# EAGLE design bbc_micro (EAGLE 9.6.1)
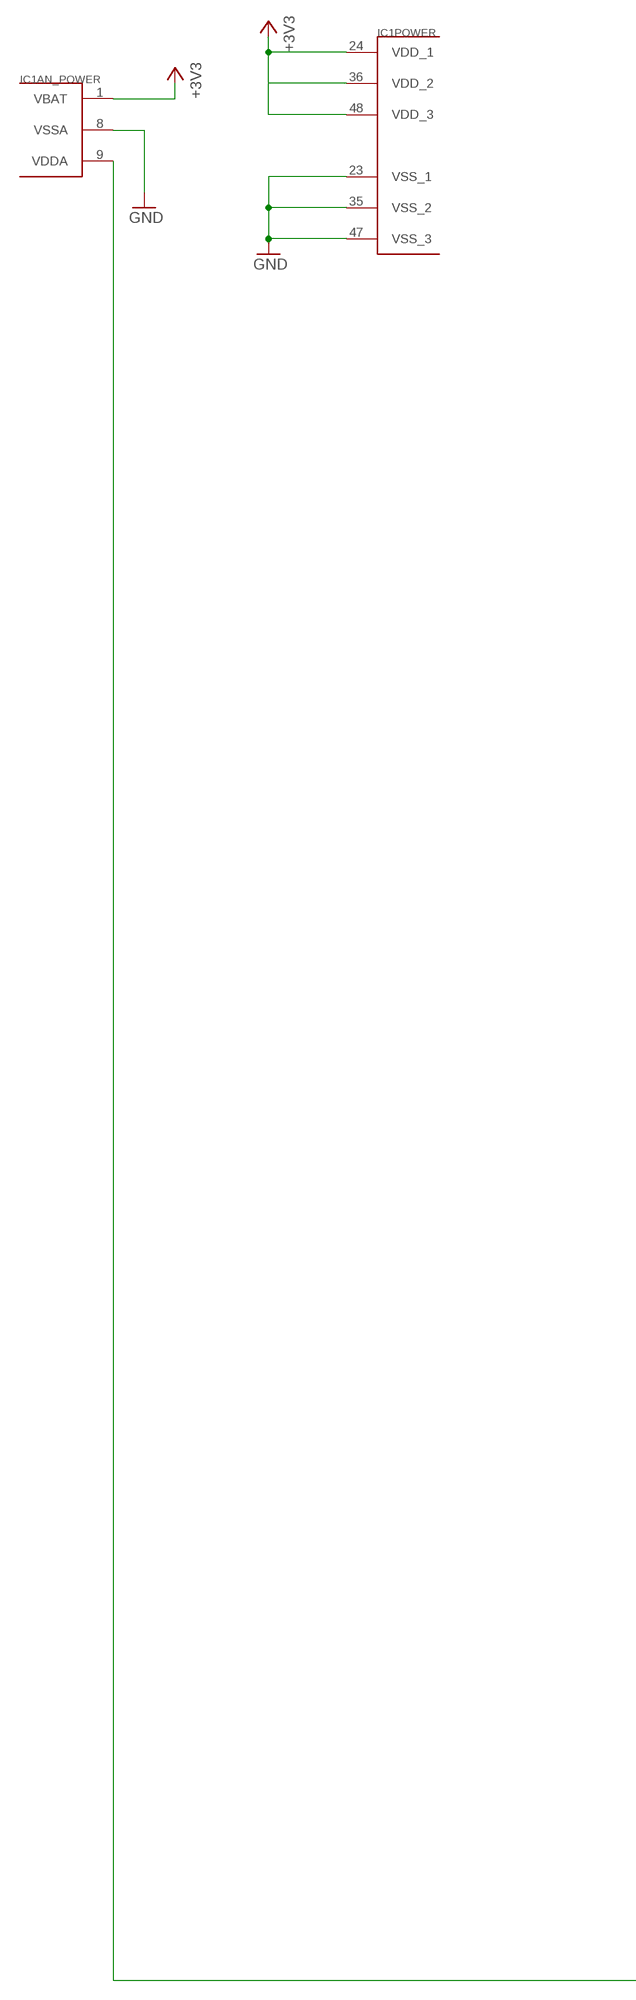
[diagram p0: schematic, sheet 1, part 1 of 2]
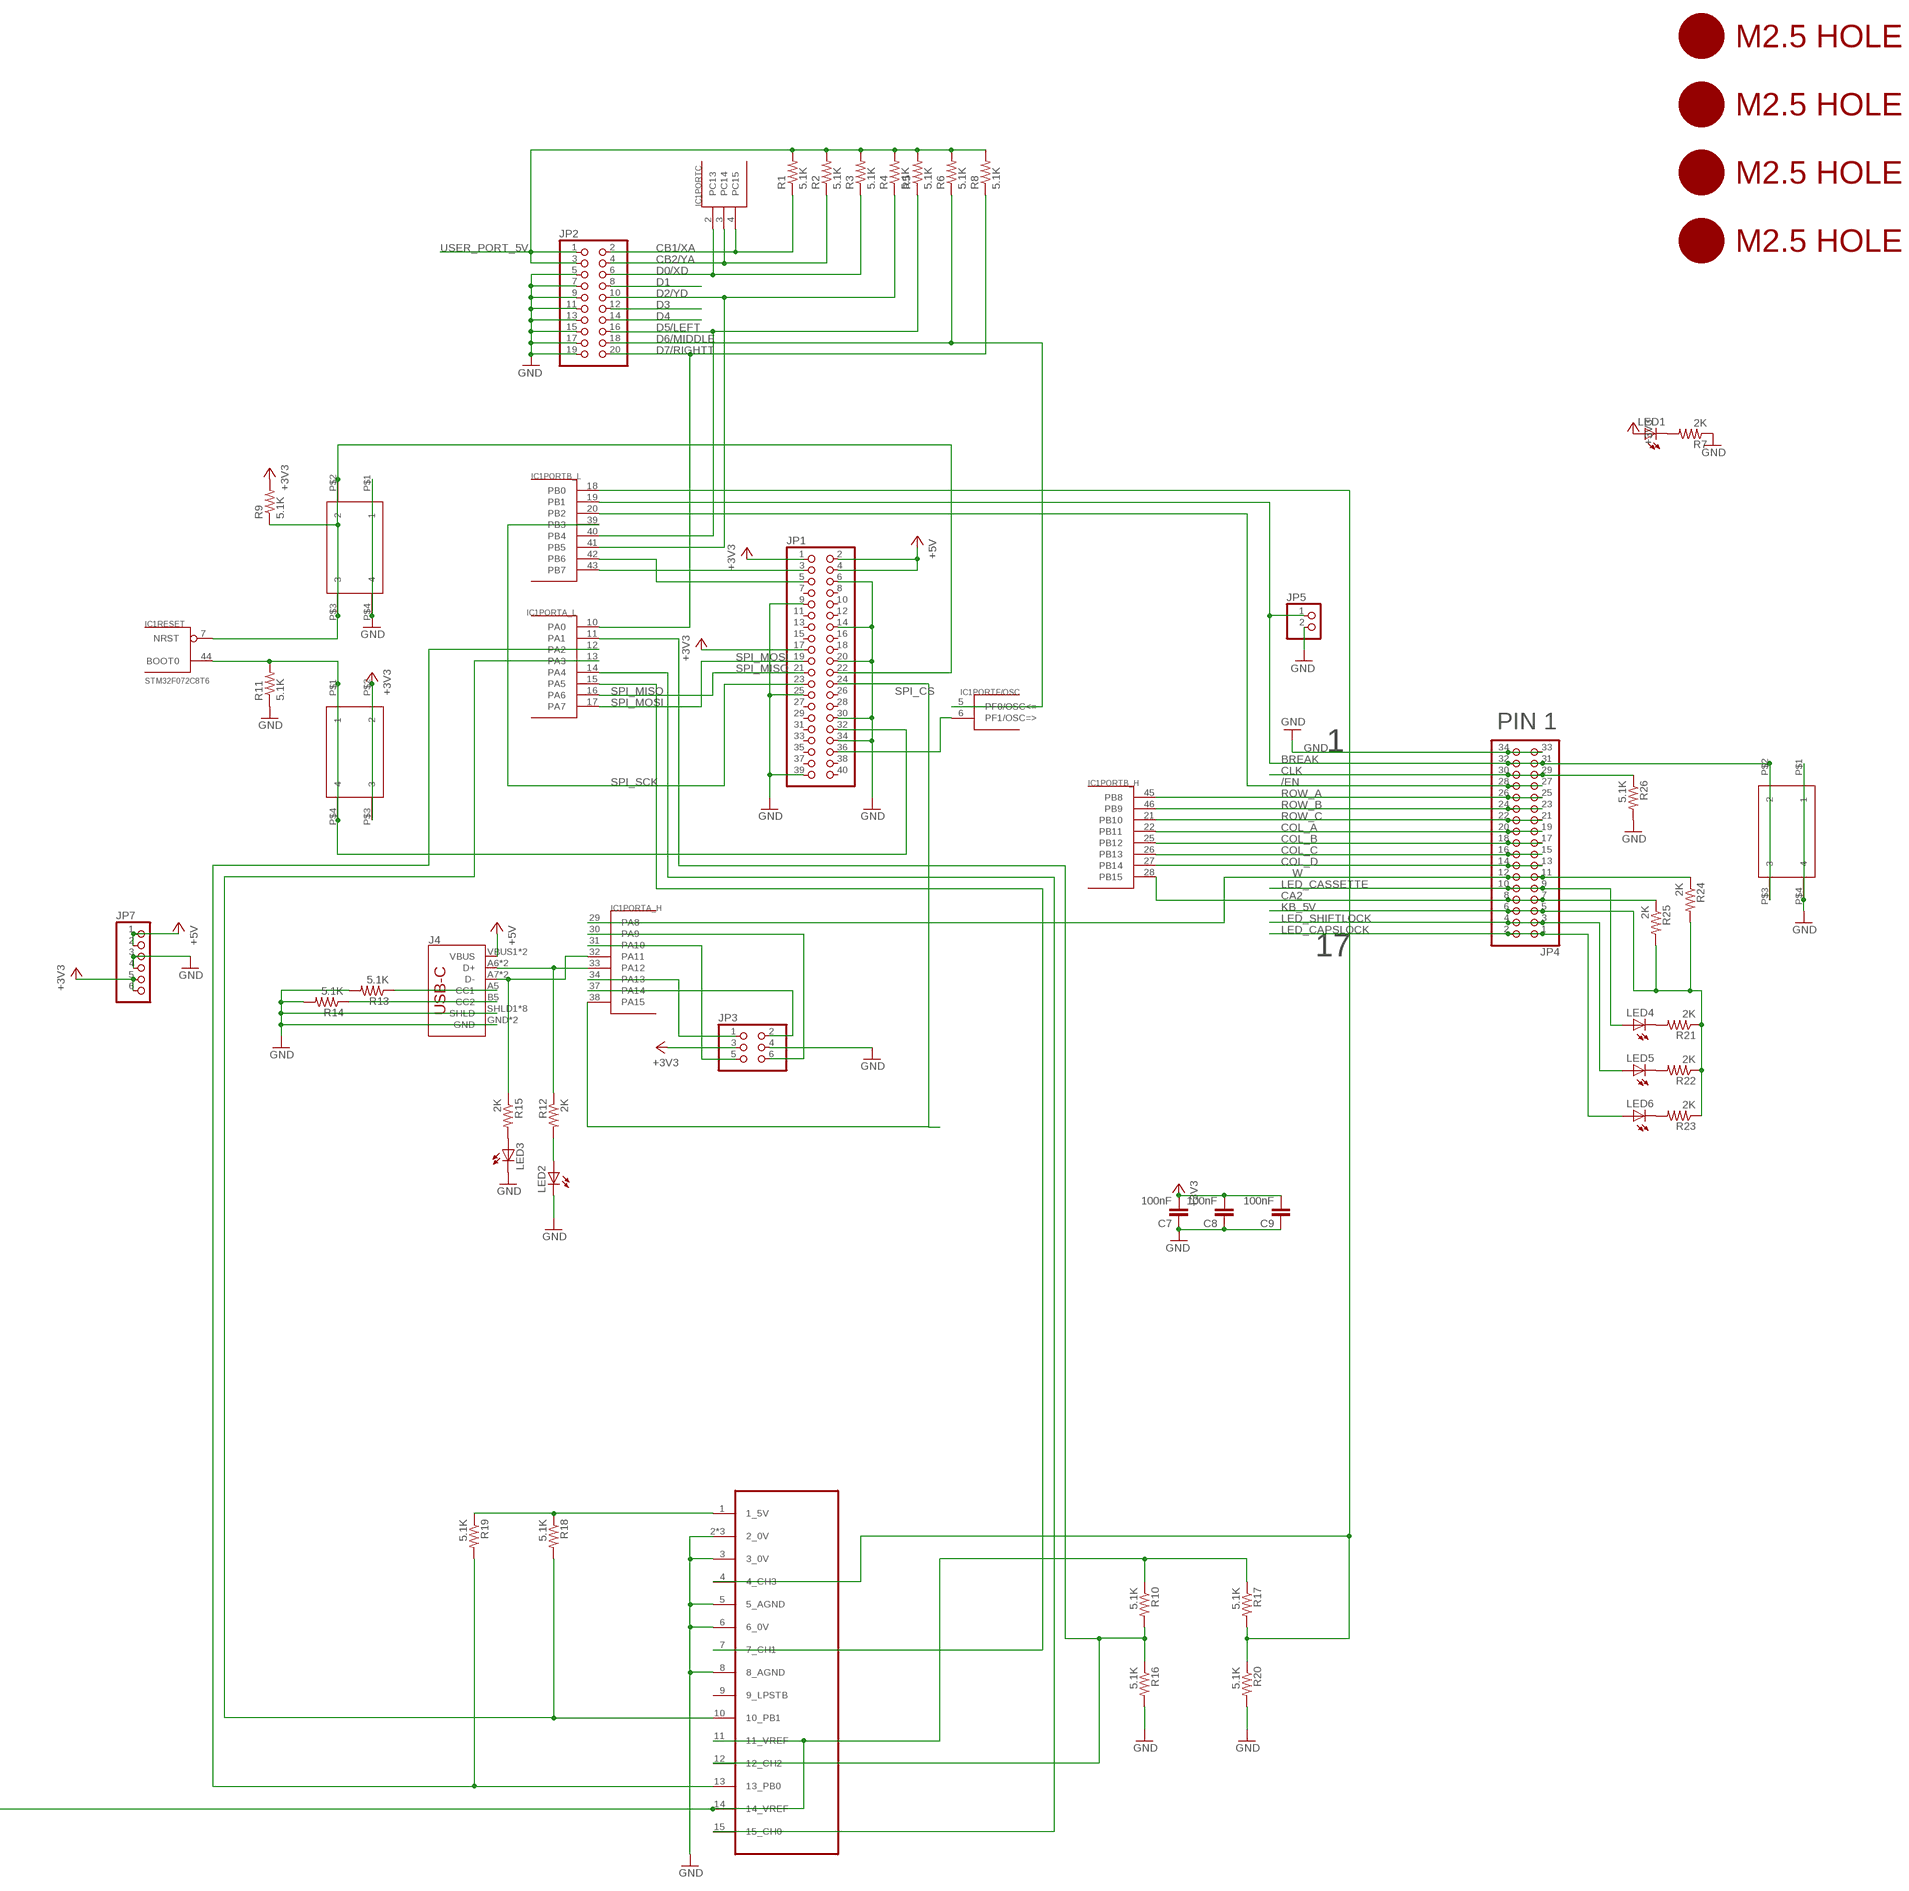
[diagram p1: schematic, sheet 1, part 2 of 2]

## Parts
C7  100nF  CAP0805  [0805@1]
C8  100nF  CAP0805  [0805@1]
C9  100nF  CAP0805  [0805@1]
IC1  STM32F072C8T6  [TQFP48]
J4  USB_C16PIN  [USB-C-16P]
JP1  PINHD-2X20-BIG  [2X20-BIG]
JP2  PINHD-2X10/90  [2X10/90]
JP3  PINHD-2X3  [2X03]
JP4  PINHD-2X17/90  [2X17/90]
JP5  PINHD-1X2  [1X02]
JP7  PINHD-1X6CB  [1X06-CLEANBIG]
LED1  LEDCHIP-LED0805  [CHIP-LED0805]
LED2  LEDCHIP-LED0805  [CHIP-LED0805]
LED3  LEDCHIP-LED0805  [CHIP-LED0805]
LED4  LEDCHIP-LED0805  [CHIP-LED0805]
LED5  LEDCHIP-LED0805  [CHIP-LED0805]
LED6  LEDCHIP-LED0805  [CHIP-LED0805]
R1  5.1K  RESISTOR0805-RES  [0805]
R2  5.1K  RESISTOR0805-RES  [0805]
R3  5.1K  RESISTOR0805-RES  [0805]
R4  5.1K  RESISTOR0805-RES  [0805]
R5  5.1K  RESISTOR0805-RES  [0805]
R6  5.1K  RESISTOR0805-RES  [0805]
R7  2K  RESISTOR0805-RES  [0805]
R8  5.1K  RESISTOR0805-RES  [0805]
R9  5.1K  RESISTOR0805-RES  [0805]
R10  5.1K  RESISTOR0805-RES  [0805]
R11  5.1K  RESISTOR0805-RES  [0805]
R12  2K  RESISTOR0805-RES  [0805]
R13  5.1K  RESISTOR0805-RES  [0805]
R14  5.1K  RESISTOR0805-RES  [0805]
R15  2K  RESISTOR0805-RES  [0805]
R16  5.1K  RESISTOR0805-RES  [0805]
R17  5.1K  RESISTOR0805-RES  [0805]
R18  5.1K  RESISTOR0805-RES  [0805]
R19  5.1K  RESISTOR0805-RES  [0805]
R20  5.1K  RESISTOR0805-RES  [0805]
R21  2K  RESISTOR0805-RES  [0805]
R22  2K  RESISTOR0805-RES  [0805]
R23  2K  RESISTOR0805-RES  [0805]
R24  2K  RESISTOR0805-RES  [0805]
R25  2K  RESISTOR0805-RES  [0805]
R26  5.1K  RESISTOR0805-RES  [0805]
SW1  324_SW  [342_SWICH_FOOT]
SW2  324_SW  [342_SWICH_FOOT]
SW3  324_SW  [342_SWICH_FOOT]
U$2  M2.5HOLE  [M2.5HOLE]
U$3  M2.5HOLE  [M2.5HOLE]
U$6  M2.5HOLE  [M2.5HOLE]
U$7  M2.5HOLE  [M2.5HOLE]
U$9  BBC_15P  [DA15]

## Nets
+3V3: C7.2 C8.2 C9.2 IC1.1(AN_POWER:VBAT) IC1.24(POWER:VDD_1) IC1.36(POWER:VDD_2) IC1.48(POWER:VDD_3) JP1.1 JP1.17 JP3.3 JP7.5 JP7.6 LED1.A R9.2 SW2.P$2 SW2.P$3
+5V: J4.VBUS1(VBUS) J4.VBUS2(VBUS) JP1.2 JP1.4 JP7.1 JP7.2
/EN: IC1.20(PORTB_L:PB2) JP4.27 JP4.28
BREAK: IC1.19(PORTB_L:PB1) JP4.31 JP4.32 JP5.1 SW3.P$2 SW3.P$3
CA2: IC1.28(PORTB_H:PB15) JP4.7 JP4.8 R25.1
CB1/XA: IC1.4(PORTC:PC15) JP2.2 R1.1
CB2/YA: IC1.3(PORTC:PC14) JP2.4 R2.1
CLK: JP4.29 JP4.30 R26.1
COL_A: IC1.22(PORTB_H:PB11) JP4.19 JP4.20
COL_B: IC1.25(PORTB_H:PB12) JP4.17 JP4.18
COL_C: IC1.26(PORTB_H:PB13) JP4.15 JP4.16
COL_D: IC1.27(PORTB_H:PB14) JP4.13 JP4.14
D0/XD: IC1.2(PORTC:PC13) JP2.6 R3.1
D1: JP2.8
D2/YD: IC1.41(PORTB_L:PB5) JP2.10 R4.1
D3: JP2.12
D4: JP2.14
D5/LEFT: IC1.40(PORTB_L:PB4) JP2.16 R5.1
D6/MIDDLE: IC1.5(PORTF/OSC:PF0/OSC<=) JP2.18 R6.1
D7/RIGHTT: IC1.10(PORTA_L:PA0) JP2.20 R8.1
GND: C7.1 C8.1 C9.1 IC1.8(AN_POWER:VSSA) IC1.23(POWER:VSS_1) IC1.35(POWER:VSS_2) IC1.47(POWER:VSS_3) J4.GND J4.GND2(GND) J4.SHLD1(SHLD) J4.SHLD2(SHLD) J4.SHLD3(SHLD) J4.SHLD4(SHLD) J4.SHLD5(SHLD) J4.SHLD6(SHLD) J4.SHLD7(SHLD) J4.SHLD8(SHLD) JP1.6 JP1.9 JP1.14 JP1.20 JP1.25 JP1.30 JP1.34 JP1.39 JP2.5 JP2.7 JP2.9 JP2.11 JP2.13 JP2.15 JP2.17 JP2.19 JP3.4 JP4.33 JP4.34 JP5.2 JP7.3 JP7.4 LED2.C LED3.C R7.1 R11.1 R13.2 R14.2 R16.2 R20.2 R26.2 SW1.P$1 SW1.P$4 SW3.P$1 SW3.P$4 U$9.2(2_0V) U$9.3(3_0V) U$9.5(5_AGND) U$9.6(6_0V) U$9.8(8_AGND) U$9.G1(2_0V) U$9.G2(2_0V)
KB_5V: JP4.5 JP4.6 R21.1 R22.1 R23.1 R24.2 R25.2
LED_CAPSLOCK: JP4.1 JP4.2 LED6.A
LED_CASSETTE: JP4.9 JP4.10 LED4.A
LED_SHIFTLOCK: JP4.3 JP4.4 LED5.A
N$1: J4.A5(CC1) R13.1
N$2: LED2.A R12.2
N$3: LED4.C R21.2
N$4: IC1.14(PORTA_L:PA4) U$9.15(15_CH0)
N$5: IC1.15(PORTA_L:PA5) U$9.7(7_CH1)
N$6: IC1.31(PORTA_H:PA10) JP3.5
N$7: J4.B5(CC2) R14.1
N$8: IC1.33(PORTA_H:PA12) J4.A6(D+) J4.B6(D+) R12.1
N$9: IC1.32(PORTA_H:PA11) J4.A7(D-) J4.B7(D-) R15.1
N$11: IC1.9(AN_POWER:VDDA) R10.1 R17.1 U$9.11(11_VREF) U$9.14(14_VREF)
N$12: IC1.18(PORTB_L:PB0) R17.2 R20.1 U$9.4(4_CH3)
N$13: IC1.7(RESET:NRST) JP1.22 R9.1 SW1.P$2 SW1.P$3
N$14: IC1.30(PORTA_H:PA9) JP3.6
N$15: IC1.34(PORTA_H:PA13) JP3.1
N$16: IC1.37(PORTA_H:PA14) JP3.2
N$17: IC1.11(PORTA_L:PA1) R10.2 R16.1 U$9.12(12_CH2)
N$18: IC1.44(RESET:BOOT0) JP1.32 R11.2 SW2.P$1 SW2.P$4
N$20: R18.1 R19.1 U$9.1(1_5V)
N$21: IC1.13(PORTA_L:PA3) R18.2 U$9.10(10_PB1)
N$22: IC1.42(PORTB_L:PB6) JP1.5
N$23: IC1.43(PORTB_L:PB7) JP1.3
N$26: LED5.C R22.2
N$27: LED6.C R23.2
N$28: LED3.A R15.2
N$29: LED1.C R7.2
N$30: IC1.12(PORTA_L:PA2) R19.2 U$9.13(13_PB0)
N$37: IC1.6(PORTF/OSC:PF1/OSC=>) JP1.36
ROW_A: IC1.45(PORTB_H:PB8) JP4.25 JP4.26
ROW_B: IC1.46(PORTB_H:PB9) JP4.23 JP4.24
ROW_C: IC1.21(PORTB_H:PB10) JP4.21 JP4.22
SPI_CS: IC1.38(PORTA_H:PA15) JP1.24
SPI_MISO: IC1.16(PORTA_L:PA6) JP1.21
SPI_MOSI: IC1.17(PORTA_L:PA7) JP1.19
SPI_SCK: IC1.39(PORTB_L:PB3) JP1.23
USER_PORT_5V: JP2.1 JP2.3 R1.2 R2.2 R3.2 R4.2 R5.2 R6.2 R8.2
W: IC1.29(PORTA_H:PA8) JP4.11 JP4.12 R24.1
Unconnected: JP1.7 JP1.8 JP1.10 JP1.11 JP1.12 JP1.13 JP1.15 JP1.16 JP1.18 JP1.26 JP1.27 JP1.28 JP1.29 JP1.31 JP1.33 JP1.35 JP1.37 JP1.38 JP1.40 U$9.9(9_LPSTB)

## Notes on the sheet
- PIN 1
- 1
- 17

## Library data of the parts
C7-C9 = clock:CAP: Capacitor Standard 0603 ceramic capacitor, and 0.1" leaded capacitor.
IC1 = clock:STM32F072C8T6: ST STM32F072 48pin LQFP
J4 = SparkFun-Connectors:USB_C: USB Type C 16Pin Connector Super Speed pins not available on the 16-pin purely SMD connector so this part is best for USB 2.0 implementations. D1 and D2 are tied together enabling D+/- no matter which way the cable is plugged into the connector. The two channel configuration pins (CC1/2) are exposed. These are normally connected to ground via 5.1k resistors but can be reconfigured for high current/high power applications.; PROD_ID: CONN-14122
JP1 = adafruit_changed:PINHD-2X20: PIN HEADER
JP2 = pinhead:PINHD-2X10: PIN HEADER
JP3 = pinhead:PINHD-2X3: PIN HEADER
JP4 = pinhead:PINHD-2X17: PIN HEADER
JP5 = pinhead:PINHD-1X2: PIN HEADER
JP7 = adafruit:PINHD-1X6: PIN HEADER
LED1-LED6 = adafruit:LED: LED OSRAM: - CHIPLED LG R971, LG N971, LY N971, LG Q971, LY Q971, LO R971, LY R971 LH N974, LH R974 LS Q976, LO Q976, LY Q976 LO Q996 - Hyper CHIPLED LW Q18S LB Q993, LB Q99A, LB R99A - SideLED LS A670, LO A670, LY A670, LG A670, LP A670 LB A673, LV A673, LT A673, LW A673 LH A674 LY A675 LS A676, LA A676, LO A676, LY A676, LW A676 LS A679, LY A679, LG A679 - Hyper Micro SIDELED® LS Y876, LA Y876, LO Y876, LY Y876 LT Y87S - SmartLED LW L88C, LW L88S LB L89C, LB L89S, LG L890 LS L89K, LO L89K, LY L89K LS L896, LA L896, LO L896, LY L896 - TOPLED LS T670, LO T670, LY T670, LG T670, LP T670 LSG T670, LSP T670, LSY T670, LOP T670, LYG T670 LG T671, LOG T671, LSG T671 LB T673, LV T673, LT T673, LW T673 LH T674 LS T676, LA T676, LO T676, LY T676, LB T676, LH T676, LSB T676, LW T676 LB T67C, LV T67C, LT T67C, LS T67K, LO T67K, LY T67K, LW E67C LS E67B, LA E67B, LO E67B, LY E67B, LB E67C, LV E67C, LT E67C LW T67C LS T679, LY T679, LG T679 LS T770, LO T770, LY T770, LG T770, LP T770 LB T773, LV T773, LT T773, LW T773 LH T774 LS E675, LA E675, LY E675, LS T675 LS T776, LA T776, LO T776, LY T776, LB T776 LHGB T686 LT T68C, LB T68C - Hyper Mini TOPLED® LB M676 - Mini TOPLED Santana® LG M470 LS M47K, LO M47K, LY M47K Source: http://www.osram.convergy.de/
R1-R26 = SparkFun-Passives:RESISTOR: Resistor Basic schematic elements and footprints for 0603, 1206, and PTH resistors.
SW1-SW3 = 3pos_slide_switch_centered:324_SW
U$2 U$3 U$6 U$7 = f1c100s:M2.5HOLE
U$9 = bbc_micro:BBC_15P

## Net classes
1 power: width 0.178 mm

## Board
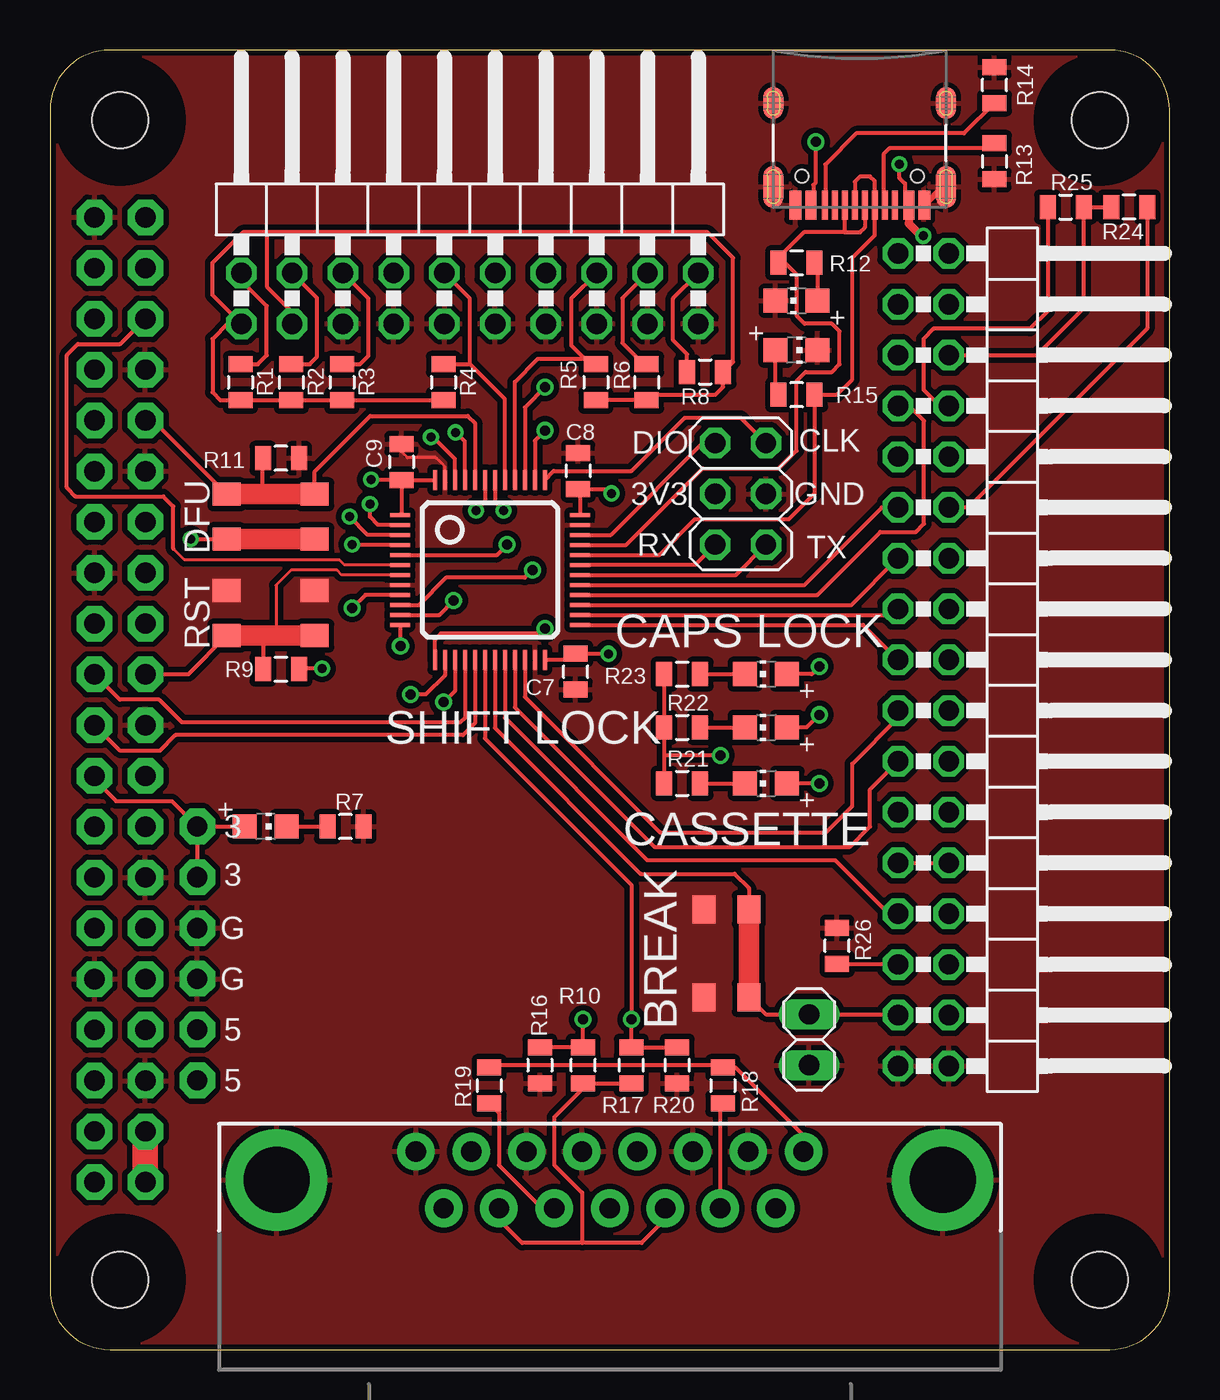
[diagram p2: board, top side]
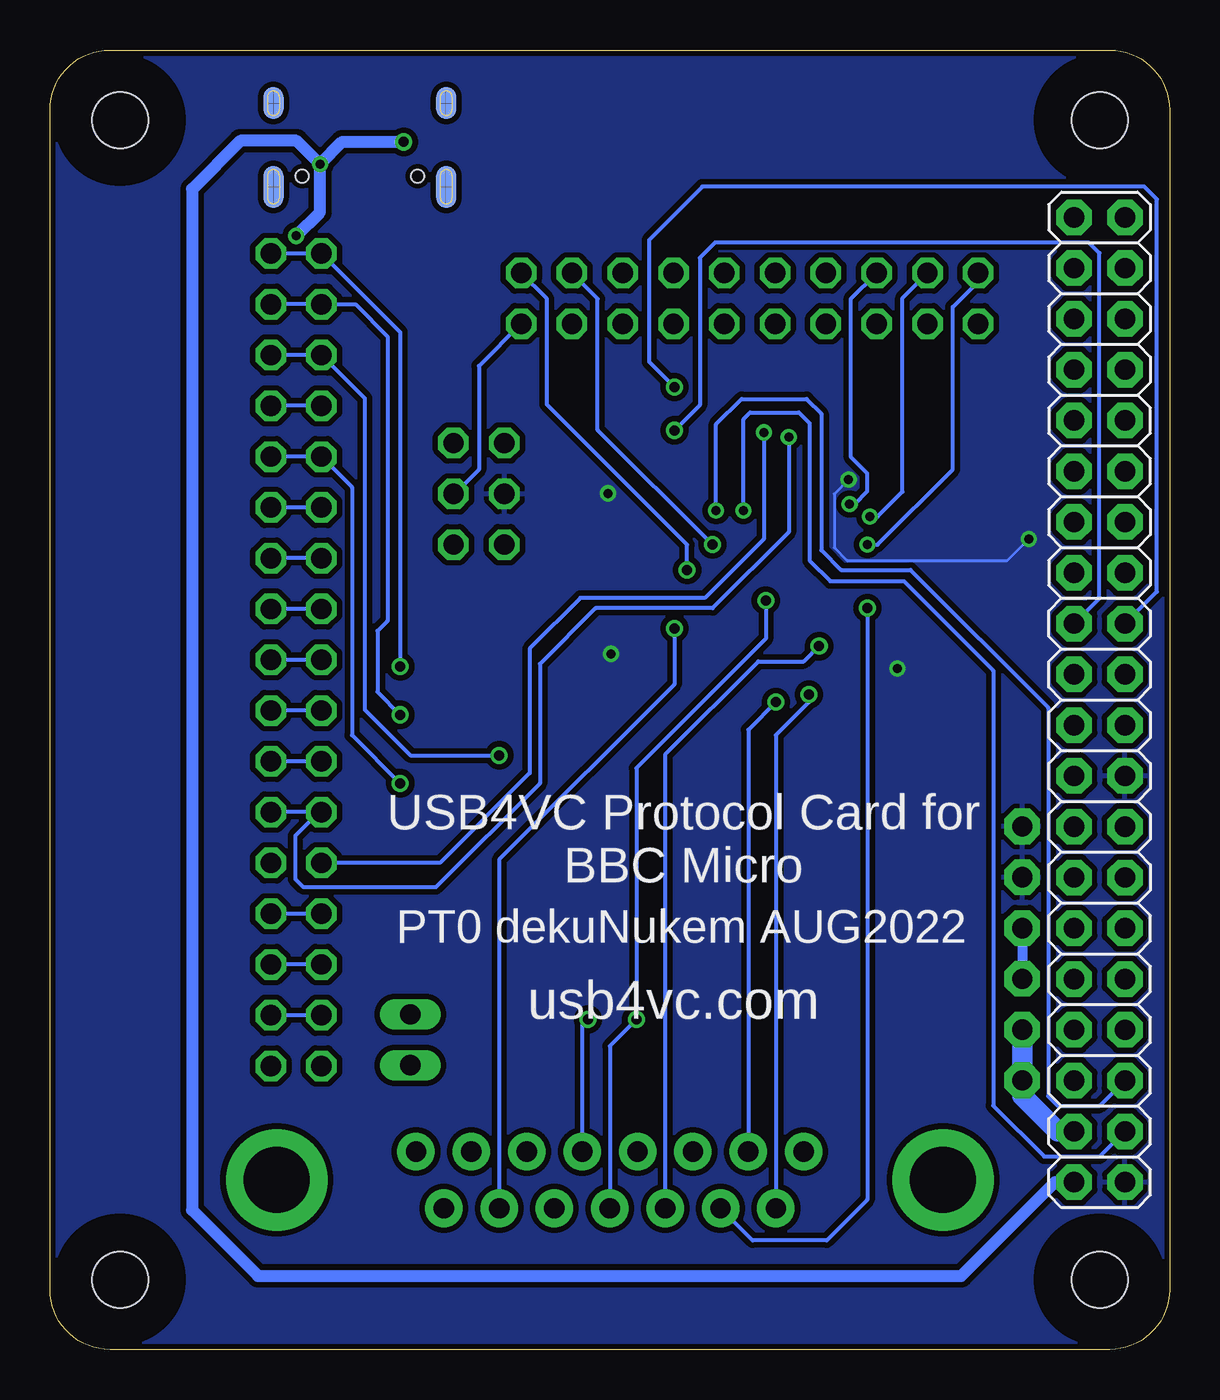
[diagram p3: board, bottom side, seen from below]

Size 56 x 65 mm. Coordinates in mm from the lower left corner, seen from the top.
Outline: 3,0 53,0 arc90 56,3 56,62 arc90 53,65 3,65 arc90 0,62 0,3 arc90 3,0
Copper layers (1*16): Top 0.035mm / dielectric 1.5mm / Bottom 0.035mm
Design rules "deku_2layer_6mil": minimum track width 6mil, minimum drill 15mil, track to track 6mil, track to pad 6mil, pad to pad 6mil, via to via 6mil, smd to smd 6mil, copper to edge 10mil, drill to drill 6mil, minimum pad ring 7mil, minimum via ring 7mil, stop-mask expansion 4mil, vias tented up to drill 25mil, thermal gap 10mil

### Footprints (pad centres in the part's own frame; a part is rotated, then mirrored left to right if it is on the bottom)
0805@1 = smd 0.8 x 1.2: 1 -0.9,0; 2 0.9,0
TQFP48 = smd 0.2 x 1: 1 -2.75,-4.5; 2 -2.25,-4.5; 3 -1.75,-4.5; 4 -1.25,-4.5; 5 -0.75,-4.5; 6 -0.25,-4.5; 7 0.25,-4.5; 8 0.75,-4.5; 9 1.25,-4.5; 10 1.75,-4.5; 11 2.25,-4.5; 12 2.75,-4.5; 25 2.75,4.5; 26 2.25,4.5; 27 1.75,4.5; 28 1.25,4.5; 29 0.75,4.5; 30 0.25,4.5; 31 -0.25,4.5; 32 -0.75,4.5; 33 -1.25,4.5; 34 -1.75,4.5; 35 -2.25,4.5; 36 -2.75,4.5 | smd 1 x 0.2: 13 4.5,-2.75; 14 4.5,-2.25; 15 4.5,-1.75; 16 4.5,-1.25; 17 4.5,-0.75; 18 4.5,-0.25; 19 4.5,0.25; 20 4.5,0.75; 21 4.5,1.25; 22 4.5,1.75; 23 4.5,2.25; 24 4.5,2.75; 37 -4.5,2.75; 38 -4.5,2.25; 39 -4.5,1.75; 40 -4.5,1.25; 41 -4.5,0.75; 42 -4.5,0.25; 43 -4.5,-0.25; 44 -4.5,-0.75; 45 -4.5,-1.25; 46 -4.5,-1.75; 47 -4.5,-2.25; 48 -4.5,-2.75
USB-C-16P = smd 0.3 x 1.45: A5 -1.25,0; A6 -0.25,0; A7 0.25,0; A8 1.25,0; B5 1.75,0; B6 0.75,0; B7 -0.75,0; B8 -1.75,0 | smd 0.6 x 1.45: GND -3.225,0; GND2 3.225,0 | smd 1 x 2.1: SHLD1 -4.32,-0.915; SHLD2 4.32,-0.915 | smd 1 x 2.1 bottom: SHLD3 -4.32,-0.915; SHLD4 4.32,-0.915 | smd 1 x 1.6: SHLD5 -4.32,-5.095; SHLD8 4.32,-5.095 | smd 1 x 1.6 bottom: SHLD6 -4.32,-5.095; SHLD7 4.32,-5.095 | smd 0.55 x 1.45: VBUS1 -2.45,0; VBUS2 2.45,0 | hole 0.65: -2.89,-1.445; 2.89,-1.445
2X20-BIG = drill 1.016 pad 1.778 octagon: 1 -24.13,-1.27; 2 -24.13,1.27; 3 -21.59,-1.27; 4 -21.59,1.27; 5 -19.05,-1.27; 6 -19.05,1.27; 7 -16.51,-1.27; 8 -16.51,1.27; 9 -13.97,-1.27; 10 -13.97,1.27; 11 -11.43,-1.27; 12 -11.43,1.27; 13 -8.89,-1.27; 14 -8.89,1.27; 15 -6.35,-1.27; 16 -6.35,1.27; 17 -3.81,-1.27; 18 -3.81,1.27; 19 -1.27,-1.27; 20 -1.27,1.27; 21 1.27,-1.27; 22 1.27,1.27; 23 3.81,-1.27; 24 3.81,1.27; 25 6.35,-1.27; 26 6.35,1.27; 27 8.89,-1.27; 28 8.89,1.27; 29 11.43,-1.27; 30 11.43,1.27; 31 13.97,-1.27; 32 13.97,1.27; 33 16.51,-1.27; 34 16.51,1.27; 35 19.05,-1.27; 36 19.05,1.27; 37 21.59,-1.27; 38 21.59,1.27; 39 24.13,-1.27; 40 24.13,1.27
2X10/90 = drill 1.016 octagon: 1 -11.43,-6.35; 2 -11.43,-3.81; 3 -8.89,-6.35; 4 -8.89,-3.81; 5 -6.35,-6.35; 6 -6.35,-3.81; 7 -3.81,-6.35; 8 -3.81,-3.81; 9 -1.27,-6.35; 10 -1.27,-3.81; 11 1.27,-6.35; 12 1.27,-3.81; 13 3.81,-6.35; 14 3.81,-3.81; 15 6.35,-6.35; 16 6.35,-3.81; 17 8.89,-6.35; 18 8.89,-3.81; 19 11.43,-6.35; 20 11.43,-3.81
2X03 = drill 1.016 octagon: 1 -2.54,-1.27; 2 -2.54,1.27; 3 0,-1.27; 4 0,1.27; 5 2.54,-1.27; 6 2.54,1.27
2X17/90 = drill 1.016 octagon: 1 -20.32,-6.35; 2 -20.32,-3.81; 3 -17.78,-6.35; 4 -17.78,-3.81; 5 -15.24,-6.35; 6 -15.24,-3.81; 7 -12.7,-6.35; 8 -12.7,-3.81; 9 -10.16,-6.35; 10 -10.16,-3.81; 11 -7.62,-6.35; 12 -7.62,-3.81; 13 -5.08,-6.35; 14 -5.08,-3.81; 15 -2.54,-6.35; 16 -2.54,-3.81; 17 0,-6.35; 18 0,-3.81; 19 2.54,-6.35; 20 2.54,-3.81; 21 5.08,-6.35; 22 5.08,-3.81; 23 7.62,-6.35; 24 7.62,-3.81; 25 10.16,-6.35; 26 10.16,-3.81; 27 12.7,-6.35; 28 12.7,-3.81; 29 15.24,-6.35; 30 15.24,-3.81; 31 17.78,-6.35; 32 17.78,-3.81; 33 20.32,-6.35; 34 20.32,-3.81
1X02 = drill 1.016 long: 1 -1.27,0; 2 1.27,0
1X06-CLEANBIG = drill 1.016 pad 1.778 octagon: 1 -6.35,0; 2 -3.81,0; 3 -1.27,0; 4 1.27,0; 5 3.81,0; 6 6.35,0
CHIP-LED0805 = smd 1.2 x 1.2: A 0,-1.05; C 0,1.05
0805 = smd 0.8 x 1.2: 1 -0.9,0; 2 0.9,0
342_SWICH_FOOT = smd 1.4 x 1.15: P$1 -2.2,-1.125; P$2 -2.2,1.125; P$3 2.2,1.125; P$4 2.2,-1.125
M2.5HOLE = hole 2.8: 0,0
DA15 = drill 1.016 pad 1.88: 1 -9.69,-1.42; 2 -6.92,-1.42; 3 -4.15,-1.42; 4 -1.38,-1.42; 5 1.39,-1.42; 6 4.16,-1.42; 7 6.93,-1.42; 8 9.7,-1.42; 9 -8.3,1.42; 10 -5.53,1.42; 11 -2.77,1.42; 12 0,1.42; 13 2.77,1.42; 14 5.54,1.42; 15 8.31,1.42 | drill 3.302 pad 5.08: G1 -16.66,0; G2 16.67,0

### Placement (x,y rotation side)
C7  26.29,33.91 90 top
C8  26.42,43.94 270 top
C9  17.58,44.4 270 top
IC1  22,39 270 top
J4  40.5,57.25 180 top
JP1  3.5,32.5 90 bottom
JP2  21,57.66 0 top
JP3  34.54,42.8 270 top
JP4  48.77,34.5 270 top
JP5  37.97,15.49 270 top
JP7  7.37,19.81 90 top
LED1  10.79,26.16 270 top
LED2  37.34,52.45 90 top
LED3  37.34,49.99 270 top
LED4  35.81,28.32 90 top
LED5  35.81,31.11 90 top
LED6  35.81,33.78 90 top
R1  9.53,48.39 270 top
R2  12.06,48.39 270 top
R3  14.61,48.39 270 top
R4  19.68,48.39 270 top
R5  27.3,48.39 270 top
R6  29.84,48.39 270 top
R7  14.78,26.16 180 top
R8  32.77,48.9 0 top
R9  11.56,34.04 0 top
R10  26.67,14.22 90 top
R11  11.56,44.58 180 top
R12  37.34,54.36 0 top
R13  47.24,59.44 270 top
R14  47.24,63.25 90 top
R15  37.34,47.75 180 top
R16  24.51,14.22 270 top
R17  29.08,14.22 90 top
R18  33.66,13.21 270 top
R19  21.97,13.21 270 top
R20  31.37,14.22 270 top
R21  31.62,28.32 0 top
R22  31.62,31.11 0 top
R23  31.62,33.78 0 top
R24  53.98,57.15 180 top
R25  50.8,57.15 0 top
R26  39.37,20.19 90 top
SW1  11.05,36.83 180 top
SW2  11.05,41.66 180 top
SW3  33.83,19.81 270 top
U$2  3.5,3.5 0 top
U$3  52.5,3.5 0 top
U$6  3.5,61.5 0 top
U$7  52.5,61.5 0 top
U$9  28,8.48 180 top

### Tracks (layer width: path | path; a pad name or v marks a point on that pad's centre or on a via)
+3V3  (via drill 0.45)
  Top 0.203: C9.2 17.57,43.51 v16.05,43.51 | C9.2 IC1.48 | C9.2 17.58,41.83 IC1.1 | R9.2 12.48,34.06 v13.61,34.06 | JP1.17 2.23,28.5 3.3,27.43 6.1,27.43 JP7.6 | JP7.6 JP7.5 | v27.94,34.8 26.3,34.8 C7.2 25.98,34.5 IC1.24 | v7.04,40.54 SW2.P$3 | v28.09,42.82 27.88,43.04 C8.2 26.5,42.96 IC1.36 | JP7.6 LED1.A
  Top 1.016: SW2.P$3 SW2.P$2
  Bottom 0.152: v16.05,43.51 16.76,42.8 16.76,40.11 16.13,39.47 8.1,39.47 v7.04,40.54
  pour Bottom (isolate 0.279, rank 2): 0,3 0,62 arc-90 3,65 53,65 arc-90 56,62 56,3 arc-90 53,0 3,0 arc-90
+5V  (via drill 0.45, 0.5)
  Top 0.203: J4.VBUS2 38.18,57.37 38.18,58.24 38.3,58.37 v38.3,60.4 | J4.VBUS1 42.77,57.42 42.77,58.32 42.49,58.6 v42.49,59.28
  Top 0.406: J4.VBUS1 42.95,56.31 43.56,55.7 v43.69,55.7
  Top 1.27: JP1.4 JP1.2
  Bottom 0.61: v43.69,55.7 42.49,56.9 v42.49,59.28 | v42.49,59.28 41.38,60.4 v38.3,60.4 | v42.49,59.28 43.66,60.45 46.48,60.45 48.9,58.04 48.9,6.99 45.59,3.68 10.41,3.68 5.73,8.37 JP1.2
  Bottom 1.016: JP1.4 5.58,10.91 7.37,12.7 JP7.1 JP7.2
/EN
  Top 0.203: IC1.20 22.75,31.61 29.87,24.49 39.27,24.49 41.95,21.8 JP4.27
  Bottom 0.203: JP4.27 JP4.28
BREAK
  Top 0.203: IC1.19 22.25,31.09 29.54,23.8 34.24,23.8 34.96,23.08 SW3.P$2 | SW3.P$3 35.81,16.76 JP5.1 42.37,16.76 JP4.31
  Top 1.016: SW3.P$2 SW3.P$3
  Bottom 0.203: JP4.31 JP4.32
CA2
  Top 0.203: IC1.28 38.38,37.75 41.53,40.89 43.31,40.89 43.71,41.3 43.71,46.46 42.97,47.2 JP4.7 | R25.1 49.9,51.93 49.02,51.05 44.2,51.05 43.69,50.55 43.69,48.01 44.49,47.2 JP4.8
  Bottom 0.203: JP4.7 JP4.8
CB1/XA  (via drill 0.45)
  Top 0.203: IC1.4 15.12,40.25 v15.11,40.26 | R1.1 10.4,49.29 10.85,49.73 10.85,52.19 9.57,53.47 JP2.2
  Bottom 0.203: v15.11,40.26 14.61,40.26 10.85,44.02 10.85,52.15 9.57,53.42 JP2.2
CB2/YA  (via drill 0.45)
  Top 0.203: IC1.3 15.89,40.75 v14.99,41.66 | R2.1 12.99,49.29 13.36,49.66 13.36,52.6 JP2.4
  Bottom 0.203: v14.99,41.66 14.61,41.66 13.36,42.9 13.36,52.6 JP2.4
CLK
  Top 0.203: R26.1 42.38,19.29 JP4.29
  Bottom 0.203: JP4.29 JP4.30
COL_A
  Top 0.203: IC1.22 23.75,32.64 30.52,25.86 38.82,25.86 40.13,27.18 40.13,29.29 42.42,31.58 JP4.19
  Bottom 0.203: JP4.19 JP4.20
COL_B
  Top 0.203: JP4.17 40.67,36.25 IC1.25
  Bottom 0.203: JP4.17 JP4.18
COL_C
  Top 0.203: JP4.15 42.13,36.75 IC1.26
  Bottom 0.203: JP4.15 JP4.16
COL_D
  Top 0.203: IC1.27 40.09,37.25 JP4.13
  Bottom 0.203: JP4.13 JP4.14
D0/XD  (via drill 0.45)
  Top 0.203: IC1.2 16.41,41.25 16,41.66 v16,42.29 | R3.1 15.51,49.29 15.93,49.71 15.93,52.57 JP2.6
  Bottom 0.203: v16,42.29 15.75,42.29 15.11,42.93 15.11,43.81 15.93,44.63 15.93,52.57 JP2.6
D2/YD
  Top 0.203: JP2.10 20.98,52.6 20.98,49.3 | IC1.41 22.75,47.53 20.98,49.3 | R4.1 20.97,49.29 20.98,49.3
D5/LEFT
  Top 0.203: JP2.16 26.09,52.58 26.09,50.22 27.02,49.29 R5.1 27.05,49.54 24.39,49.54 23.25,48.4 IC1.40
D6/MIDDLE  (via drill 0.5)
  Top 0.203: JP2.18 28.63,52.58 28.63,50.34 29.68,49.29 R6.1 | IC1.5 22.35,39.75 v22.86,40.26
  Bottom 0.203: v22.86,40.26 28.6,46 28.6,52.56 JP2.18
D7/RIGHTT  (via drill 0.5)
  Top 0.203: JP2.20 31.17,52.58 31.17,50.48 31.87,49.78 R8.1 | IC1.10 18.45,37.25 19.81,38.61 23.75,38.61 v24.13,38.99
  Bottom 0.203: JP2.20 31.14,52.56 31.14,47.27 24.13,40.26 v24.13,38.99
GND
  Top 0.152: IC1.47 19.75,44.16 19.3,44.6 17.88,44.6 17.58,44.91 C9.1
  Top 0.305: J4.GND 44.64,58.16 J4.SHLD3
  Bottom 0.203: JP2.19 34.54,49.19 34.54,44.02 35.76,42.8 JP3.4
  Bottom 0.508: JP7.4 JP7.3
  pour Top (isolate 0.279): 3,0 53,0 arc90 56,3 56,62 arc90 53,65 3,65 arc90 0,62 0,3 arc90
KB_5V  (via drill 0.5)
  Top 0.203: R23.1 R22.1 30.72,29.72 | 30.72,29.72 R21.1 | v33.53,29.72 30.72,29.72 | JP4.6 49.36,49.74 51.7,52.08 R25.2 R24.2
  Bottom 0.203: v33.53,29.72 37.97,29.72 40.26,32 40.26,47.58 JP4.5 JP4.6
LED_CAPSLOCK  (via drill 0.5)
  Top 0.203: v38.48,34.16 38.1,33.78 LED6.A
  Bottom 0.203: v38.48,34.16 38.48,50.88 JP4.1 JP4.2
LED_CASSETTE  (via drill 0.5)
  Top 0.203: v38.48,28.32 LED4.A
  Bottom 0.203: v38.48,28.32 40.89,30.73 40.89,43.14 JP4.9 JP4.10
LED_SHIFTLOCK  (via drill 0.5)
  Top 0.203: v38.48,31.75 37.85,31.11 LED5.A
  Bottom 0.203: v38.48,31.75 39.62,32.89 39.62,35.94 39.12,36.45 39.12,50.67 40.72,52.28 JP4.3 JP4.4
N$1
  Top 0.203: R13.1 46.99,60.08 42,60.08 41.7,59.78 41.7,57.3 J4.A5
N$2
  Top 0.203: R12.2 38.39,54.21 LED2.A
N$3
  Top 0.203: R21.2 LED4.C
N$4  (via drill 0.5)
  Top 0.203: IC1.14 19.75,33.72 18.8,32.77 v18.03,32.77
  Bottom 0.203: v18.03,32.77 18.03,32.38 19.69,30.73 U$9.15
N$5  (via drill 0.5)
  Top 0.203: IC1.15 20.25,32.95 v19.68,32.38
  Bottom 0.203: v19.68,32.38 21.07,31 U$9.7
N$6
  Top 0.203: IC1.31 32.27,39.25 JP3.5
N$7
  Top 0.203: J4.B5 38.77,57.27 38.77,59.27 40.34,60.83 45.72,60.83 R14.1
N$8
  Top 0.203: IC1.33 28.82,40.25 32.64,44.07 36.45,44.07 37.34,44.96 37.34,48.44 37.8,48.9 39.12,48.9 39.5,49.28 39.5,50.93 39.12,51.31 37.74,51.31 37.36,51.69 37.36,53.76 36.77,54.36 R12.1 36.44,54.61 37.71,55.88 39.75,55.88 | J4.A6 40.75,56.12 40.51,55.88 39.75,55.88 | 39.75,55.88 J4.B6
N$9
  Top 0.203: IC1.32 30.48,39.75 32.26,41.53 36.96,41.53 38.24,42.81 R15.1 39.37,47.75 40.13,48.51 40.13,54.61 41.25,55.73 J4.B7 41.25,58.45 41.02,58.67 40.51,58.67 40.25,58.41 J4.A7
N$11  (via drill 0.5)
  Top 0.203: U$9.11 30.77,6.51 29.59,5.33 26.62,5.33 | 26.62,5.33 23.62,5.33 22.46,6.5 U$9.14 | IC1.9 15.78,37.75 v15.11,37.08 | R17.1 R10.1 26.67,13.07 25.22,11.62 25.22,9.25 26.62,7.85 26.62,5.33
  Bottom 0.203: v15.11,37.08 15.11,7.49 17.14,5.46 20.86,5.46 U$9.14
N$12  (via drill 0.5)
  Top 0.203: R20.1 R17.2 v29.08,16.51 29.08,23.24 21.75,30.57 IC1.18
  Bottom 0.203: v29.08,16.51 29.38,16.21 U$9.4
N$13
  Top 0.152: IC1.7 14.59,38.75 14.35,38.99 12.06,38.99 11.3,38.23 11.3,35.7
  Top 0.203: 10.49,35.7 10.66,35.54 R9.1 | SW1.P$3 6.91,33.77 JP1.22
  Top 1.016: SW1.P$3 10.49,35.7 11.3,35.7 SW1.P$2
N$14
  Top 0.203: IC1.30 34.3,38.75 JP3.6
N$15
  Top 0.203: IC1.34 28.05,40.75 32.64,45.34 JP3.1
N$16
  Top 0.203: IC1.37 25.19,43.94 29.08,43.94 31.75,46.61 34.54,46.61 JP3.2
N$17  (via drill 0.5)
  Top 0.203: R16.1 R10.2 v26.67,16.51 | IC1.11 19.48,36.75 v20.19,37.47
  Bottom 0.203: U$9.12 28,15.18 v26.67,16.51 26.67,29.08 20.19,35.56 v20.19,37.47
N$18
  Top 0.203: 10.64,42.78 10.64,44.56 R11.2 | IC1.44 21.25,46.34 20.9,46.69 16.02,46.69 13.25,43.92 SW2.P$1 | JP1.32 5.16,46.47 SW2.P$4
  Top 1.016: SW2.P$4 10.64,42.78 SW2.P$1
N$20
  Top 0.203: U$9.1 37.69,10.71 34.29,14.11 R18.1 33.55,14.21 22.07,14.21 R19.1
N$21  (via drill 0.5)
  Top 0.203: U$9.10 33.53,12.18 R18.2 | IC1.13 19.25,35.51 19.56,35.81 24.51,35.81 v24.77,36.07
  Bottom 0.203: v24.77,36.07 24.77,33.27 33.53,24.51 U$9.10
N$22  (via drill 0.45)
  Top 0.203: IC1.42 22.25,42.39 v22.68,41.96
  Bottom 0.203: v22.68,41.96 22.68,46.28 21.41,47.55 18.16,47.55 17.42,46.81 17.42,39.98 16.43,38.99 12.95,38.99 6.07,32.11 6.07,12.68 5.59,12.19 3.49,12.19 JP1.5
N$23  (via drill 0.45)
  Top 0.203: IC1.43 21.75,42.4 v21.31,41.96
  Bottom 0.203: v21.31,41.96 21.31,46.53 20.98,46.86 18.54,46.86 18.01,46.33 18.01,39.47 16.97,38.43 13.28,38.43 8.81,33.96 8.81,12.19 6.27,9.65 3.49,9.65 JP1.3
N$26
  Top 0.203: R22.2 LED5.C
N$27
  Top 0.203: R23.2 LED6.C
N$28
  Top 0.203: R15.2 36.29,47.9 LED3.A
N$29
  Top 0.203: LED1.C R7.2
N$30  (via drill 0.5)
  Top 0.203: R19.2 22.45,11.82 22.45,9.22 24.61,7.06 U$9.13 | IC1.12 17.5,35.2 v17.53,35.18
  Bottom 0.203: v17.53,35.18 18.29,34.42 20.57,34.42 25.23,29.76 U$9.13
N$37
  Top 0.152: IC1.6 14.72,39.25 14.48,39.5 6.73,39.5 6.17,40.06
  Top 0.203: JP1.36 3.51,50.29 1.4,50.29 0.84,49.73 0.84,43.1 1.27,42.67 5.66,42.67 6.17,42.16 6.17,40.06
ROW_A  (via drill 0.45)
  Top 0.203: IC1.45 20.75,45.42 v20.3,45.87 | JP4.25 JP4.26
  Bottom 0.203: JP4.25 36.49,24.34 32,28.83 32,35.05 29.46,37.59 23.24,37.59 20.3,40.54 v20.3,45.87
ROW_B  (via drill 0.45)
  Top 0.203: IC1.46 20.25,44.55 19.15,45.64 v19.05,45.64
  Bottom 0.203: v19.05,45.64 19.05,40.89 22.86,37.08 28.7,37.08 31.5,34.29 31.5,28.32 36.7,23.11 43.31,23.11 43.71,23.52 43.71,25.71 42.55,26.88 JP4.23 JP4.24
ROW_C
  Top 0.203: IC1.21 23.25,32.12 30.23,25.15 40.01,25.15 41.02,26.16 41.02,28.02 JP4.21
  Bottom 0.203: JP4.21 JP4.22
SPI_CS  (via drill 0.5)
  Top 0.203: v24.77,45.97 24.25,45.46 IC1.38
  Bottom 0.203: JP1.24 3.5,37.58 3.5,54.84 4.04,55.37 22.73,55.37 23.5,54.61 23.5,47.24 v24.77,45.97
SPI_MISO
  Top 0.203: IC1.16 20.75,31.6 20.52,31.37 6.6,31.37 5.46,32.51 3.49,32.51 JP1.21
SPI_MOSI
  Top 0.203: JP1.19 3.51,29.95 5.49,29.95 6.27,30.73 20.65,30.73 21.25,31.33 IC1.17
SPI_SCK  (via drill 0.5)
  Top 0.203: v24.77,48.13 23.75,47.12 IC1.39
  Bottom 0.203: JP1.23 0.64,37.91 0.64,57.53 1.27,58.17 23.37,58.17 26.04,55.5 26.04,49.4 v24.77,48.13
USER_PORT_5V
  Top 0.203: R4.2 R3.2 R2.2 R1.2 8.52,47.49 8.13,47.88 8.13,50.55 8.89,51.31 JP2.1 8.13,52.75 8.13,54.36 9.65,55.88 10.87,55.88 | R5.2 R6.2 30.1,47.74 33.26,47.74 33.67,48.14 R8.2 34.16,49.39 34.16,54.61 32.89,55.88 10.87,55.88 | JP2.3 12.11,51.9 10.87,53.14 10.87,55.88
W
  Top 0.203: IC1.29 37.74,38.25 41.61,42.12 JP4.11 | R24.1 54.88,51.06 45.93,42.12 JP4.12
  Bottom 0.203: JP4.11 JP4.12

### Text on the board
tNames: DIO | CLK | 3V3 | GND | DFU | RX | TX | RST | CAPS LOCK | SHIFT LOCK | 3 | CASSETTE | 3 | G | BREAK | G | 5 | 5
bNames: USB4VC Protocol Card for / BBC Micro | PT0 dekuNukem AUG2022 | usb4vc.com